# EAGLE design sonoff DIY, 3 gang(SMD version-V.1.1) (EAGLE 9.6.2)
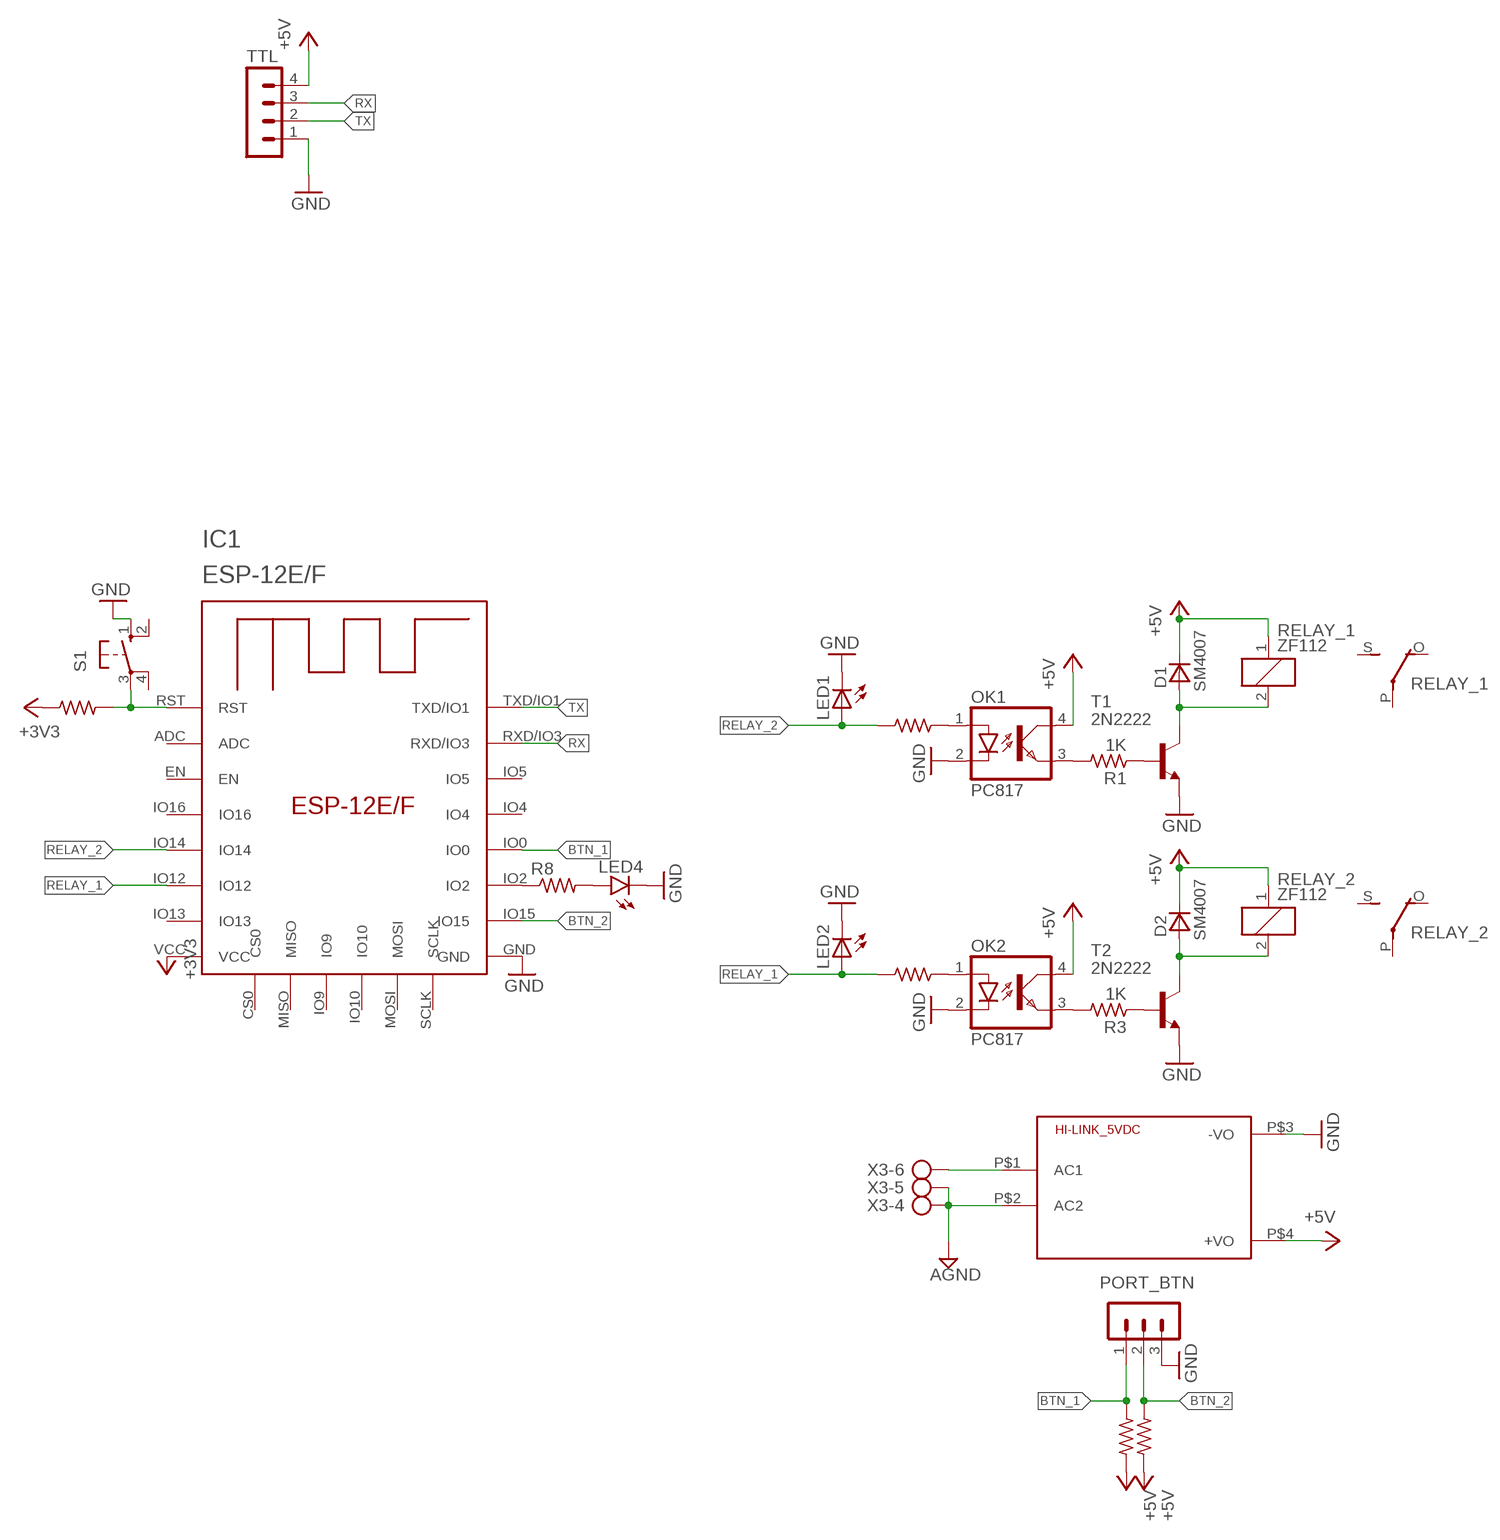
[diagram p0: schematic, sheet 1]

## Parts
D1  SM4007  [MELF-MLL41]
D2  SM4007  [MELF-MLL41]
HI-LINK_5VDC  HLK-PM013W  [HLK-PM01]
IC1  ESP-12E/F  [ESP-12E]
LED1  LED3MM  [LED3MM]
LED2  LED3MM  [LED3MM]
LED4  LED3MM  [LED3MM]
OK1  PC817  [DIL04]
OK2  PC817  [DIL04]
PORT_BTN  MA03-1  [MA03-1]
R1  1K  R_0805  [R0805]
R2  1K  R_0805  [R0805]
R3  1K  R_0805  [R0805]
R4  1K  R_0805  [R0805]
R5  1K  R_0805  [R0805]
R6  1K  R_0805  [R0805]
R7  1K  R_0805  [R0805]
R8  R-US_0207/10  [0207/10]
RELAY_1  ZF112  [ZF112]
RELAY_2  ZF112  [ZF112]
S1  10-XX  [B3F-10XX]
T1  2N2222  [TO18]
T2  2N2222  [TO18]
TTL  MA04-1  [MA04-1]
X3  SMKDSP_1,5/6  [SMKDSP_1,5/6]

## Nets
+3V3: IC1.VCC R7.2
+5V: D1.C D2.C HI-LINK_5VDC.P$4(+VO) OK1.4(COL) OK2.4(COL) R5.2 R6.2 RELAY_1.1 RELAY_2.1 TTL.4
AGND: HI-LINK_5VDC.P$2(AC2) X3.4 X3.5
BTN_1: IC1.IO0 PORT_BTN.1 R5.1
BTN_2: IC1.IO15 PORT_BTN.2 R6.1
GND: HI-LINK_5VDC.P$3(-VO) IC1.GND LED1.K(C) LED2.K(C) LED4.K(C) OK1.2(C) OK2.2(C) PORT_BTN.3 S1.1(S) T1.1(E) T2.1(E) TTL.1
N$1: OK1.1(A) R2.1
N$2: OK1.3(EMIT) R1.2
N$3: R1.1 T1.2(B)
N$4: D1.A RELAY_1.2 T1.3(C)
N$6: OK2.1(A) R4.1
N$7: HI-LINK_5VDC.P$1(AC1) X3.6
N$8: OK2.3(EMIT) R3.2
N$9: R3.1 T2.2(B)
N$10: D2.A RELAY_2.2 T2.3(C)
N$12: IC1.RST R7.1 S1.3(P)
N$15: IC1.IO2 R8.1
N$16: LED4.A R8.2
RELAY_1: IC1.IO12 LED2.A R4.2
RELAY_2: IC1.IO14 LED1.A R2.2
RX: IC1.RXD/IO3 TTL.3
TX: IC1.TXD/IO1 TTL.2
Unconnected: IC1.ADC IC1.CS0 IC1.EN IC1.IO4 IC1.IO5 IC1.IO9 IC1.IO10 IC1.IO13 IC1.IO16 IC1.MISO IC1.MOSI IC1.SCLK RELAY_1.O(2:O) RELAY_1.P(2:P) RELAY_1.S(2:S) RELAY_2.O(2:O) RELAY_2.P(2:P) RELAY_2.S(2:S) S1.2(S1) S1.4(P1) X3.1 X3.2 X3.3

## Library data of the parts
D1 D2 = _mod_diode:SM400*: SM4001 .. SM4007 General Purpose Rectifier, 1 A SMD-Version of 1N4001 .. 1N4007 Case: MELF-MLL41 = DO 213 AB Author: Dipl.-Ing. FH Rainer Bayer HHN Hochschule Heilbronn, rainer.bayer@hs-heilbronn.de Ingenieurbüro ing-rb, mail@ing-rb.de
HI-LINK_5VDC = HLK-PM01:HLK-PM01: Hi-Link Power Supply HLK-PM01 3W Author: Ahmed Said <https://github.com/AhmedSaid/EAGLELibraries>
IC1 = esp-12e-f:ESP-12E/F
LED1 LED2 LED4 = led:LED: LED OSRAM: - CHIPLED LG R971, LG N971, LY N971, LG Q971, LY Q971, LO R971, LY R971 LH N974, LH R974 LS Q976, LO Q976, LY Q976 LO Q996 - Hyper CHIPLED LW Q18S LB Q993, LB Q99A, LB R99A - SideLED LS A670, LO A670, LY A670, LG A670, LP A670 LB A673, LV A673, LT A673, LW A673 LH A674 LY A675 LS A676, LA A676, LO A676, LY A676, LW A676 LS A679, LY A679, LG A679 - Hyper Micro SIDELED® LS Y876, LA Y876, LO Y876, LY Y876 LT Y87S - SmartLED LW L88C, LW L88S LB L89C, LB L89S, LG L890 LS L89K, LO L89K, LY L89K LS L896, LA L896, LO L896, LY L896 - TOPLED LS T670, LO T670, LY T670, LG T670, LP T670 LSG T670, LSP T670, LSY T670, LOP T670, LYG T670 LG T671, LOG T671, LSG T671 LB T673, LV T673, LT T673, LW T673 LH T674 LS T676, LA T676, LO T676, LY T676, LB T676, LH T676, LSB T676, LW T676 LB T67C, LV T67C, LT T67C, LS T67K, LO T67K, LY T67K, LW E67C LS E67B, LA E67B, LO E67B, LY E67B, LB E67C, LV E67C, LT E67C LW T67C LS T679, LY T679, LG T679 LS T770, LO T770, LY T770, LG T770, LP T770 LB T773, LV T773, LT T773, LW T773 LH T774 LS E675, LA E675, LY E675, LS T675 LS T776, LA T776, LO T776, LY T776, LB T776 LHGB T686 LT T68C, LB T68C - Hyper Mini TOPLED® LB M676 - Mini TOPLED Santana® LG M470 LS M47K, LO M47K, LY M47K Source: http://www.osram.convergy.de LUXEON: - LUMILED® LXK2-PW12-R00, LXK2-PW12-S00, LXK2-PW14-U00, LXK2-PW14-V00 LXK2-PM12-R00, LXK2-PM12-S00, LXK2-PM14-U00 LXK2-PE12-Q00, LXK2-PE12-R00, LXK2-PE12-S00, LXK2-PE14-T00, LXK2-PE14-U00 LXK2-PB12-K00, LXK2-PB12-L00, LXK2-PB12-M00, LXK2-PB14-N00, LXK2-PB14-P00, LXK2-PB14-Q00 LXK2-PR12-L00, LXK2-PR12-M00, LXK2-PR14-Q00, LXK2-PR14-R00 LXK2-PD12-Q00, LXK2-PD12-R00, LXK2-PD12-S00 LXK2-PH12-R00, LXK2-PH12-S00 LXK2-PL12-P00, LXK2-PL12-Q00, LXK2-PL12-R00 Source: www.luxeon.com KINGBRIGHT: KA-3528ASYC Source: www.kingbright.com
OK1 OK2 = optocoupler:PC817: SHARP OPTO COUPLER; MPN: PC817X4J000F; OC_FARNELL: 9707727; OC_NEWARK: 97K7059
PORT_BTN = con-lstb:MA03-1: PIN HEADER; OC_FARNELL: unknown; OC_NEWARK: unknown
R1-R7 = rc-master-smd:R_: RESISTOR
R8 = resistor:R-US_: RESISTOR, American symbol
RELAY_1 RELAY_2 = relay:ZF112: RELAY 1 x switch; OC_FARNELL: unknown; OC_NEWARK: unknown
S1 = switch-omron:10-XX: OMRON SWITCH; MPN: B3F-1000; OC_FARNELL: 176432; OC_NEWARK: 36M3542
T1 T2 = transistor:2N2222: NPN TRANSISTOR
TTL = con-lstb:MA04-1: PIN HEADER; OC_FARNELL: unknown; OC_NEWARK: unknown
X3 = con-phoenix-smkdsp:SMKDSP_1,5/6: Printklemme, Nennstrom: 17,5 A, Bemessungsspannung: 250 V, Raster: 5,0 mm Source: http://eshop.phoenixcontact.de .. 1733415.pdf; MF: FARNELL; MPN: 1733619; OC_FARNELL: 3041270; OC_NEWARK: 71C4132

## Board
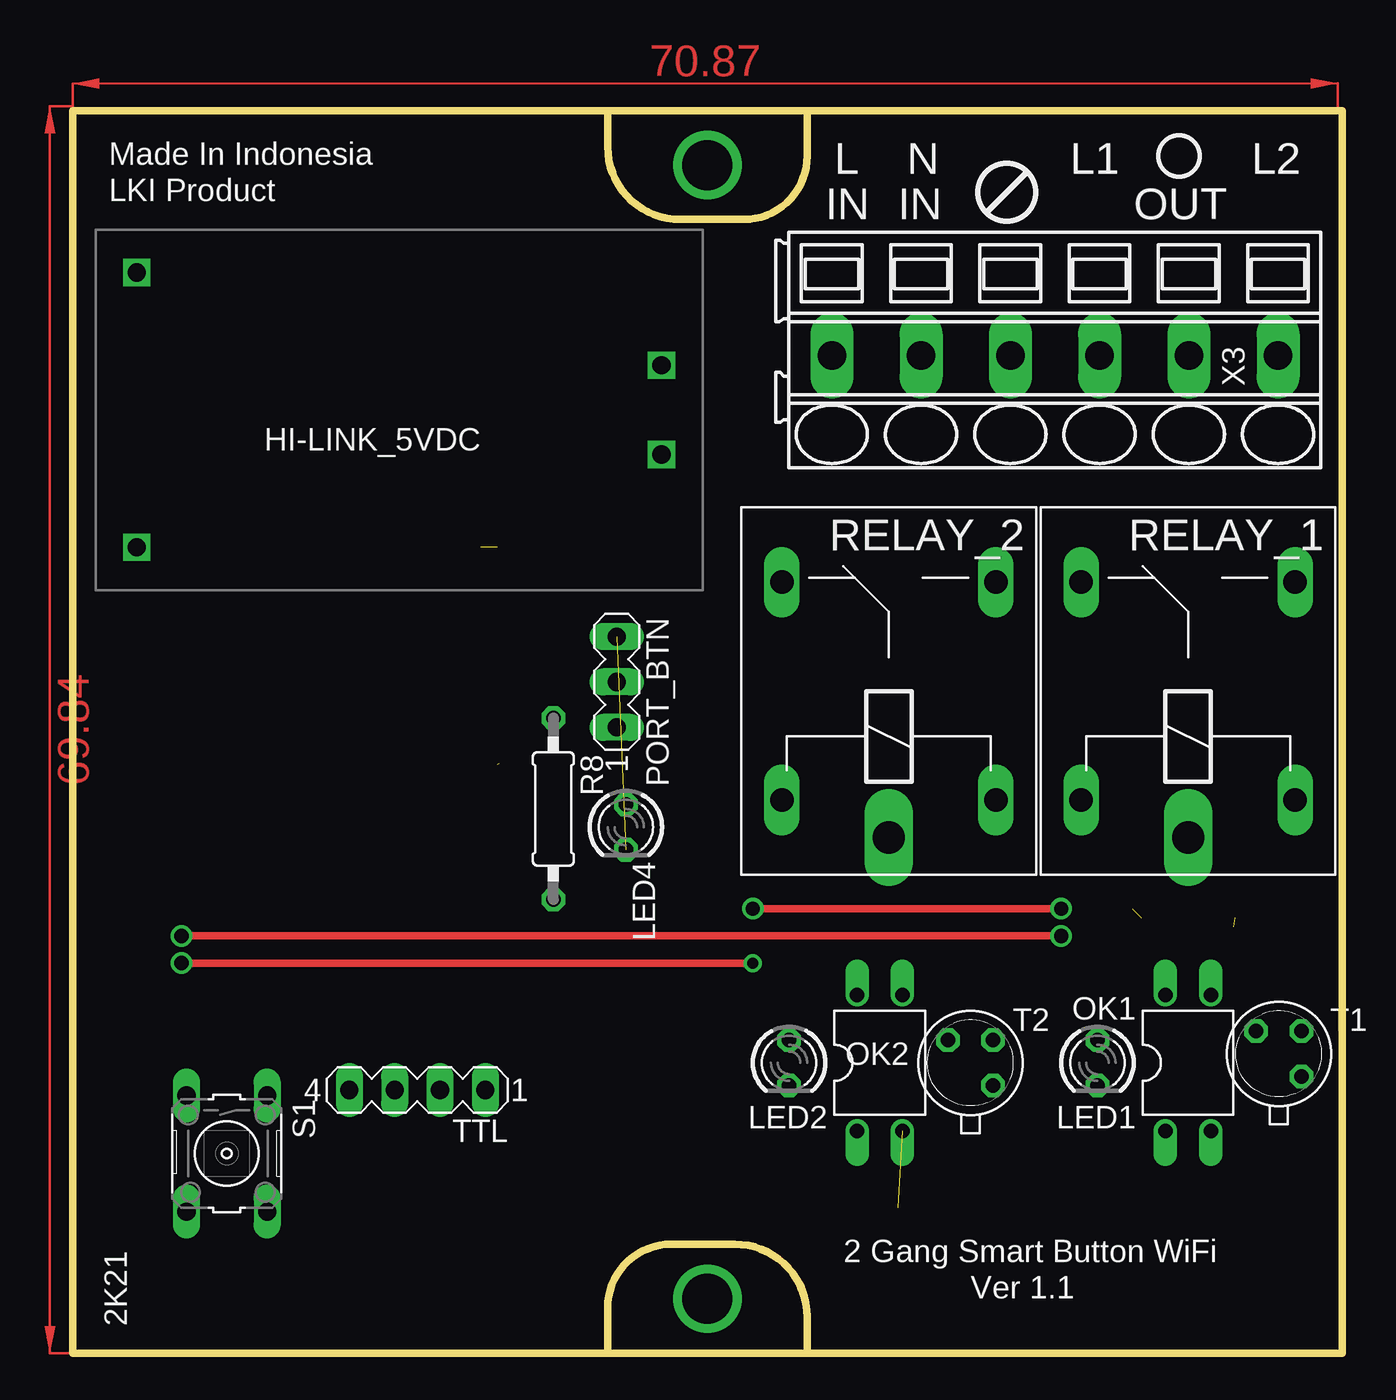
[diagram p1: board, top side]
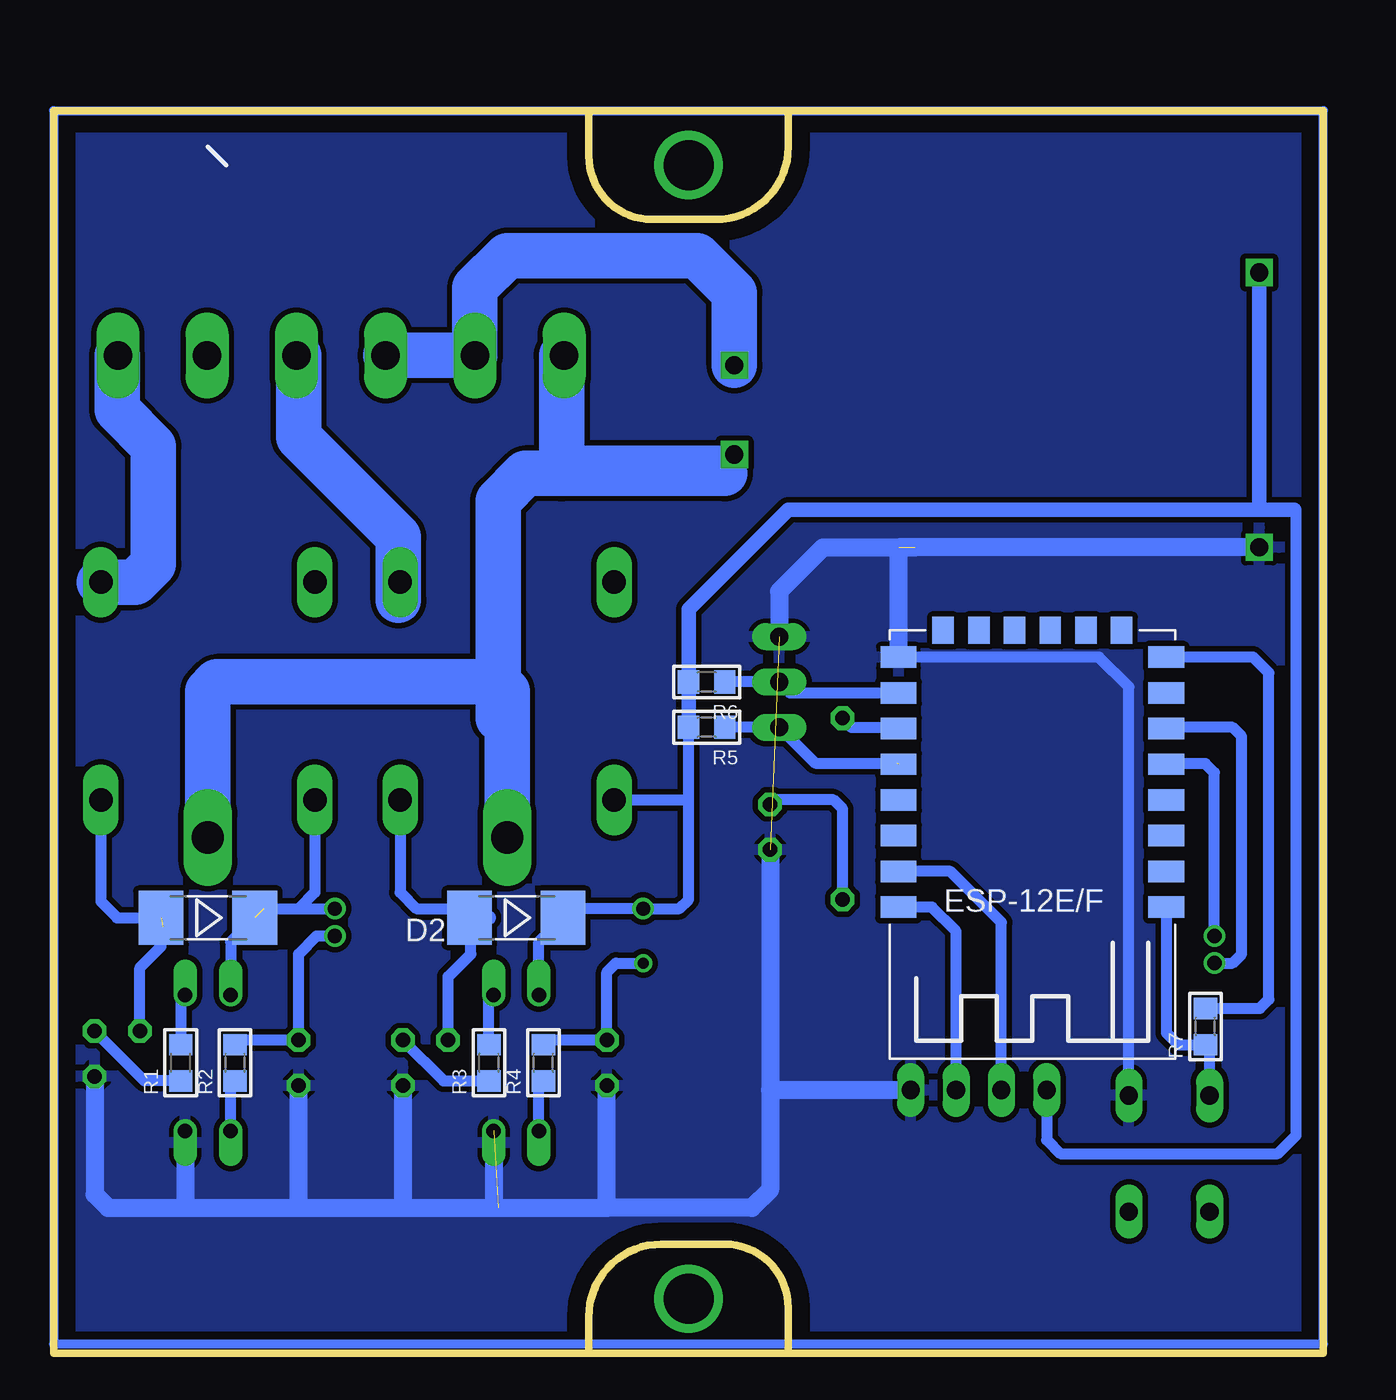
[diagram p2: board, bottom side, seen from below]

Size 71.12 x 69.6 mm. Coordinates in mm from the lower left corner, seen from the top.
Outline: 29.97,69.6 0,69.6 0,0 29.97,0
Outline: 29.97,69.6 29.97,67.56 arc90 34.04,63.5 37.59,63.5 arc90 41.15,67.06 41.15,69.6
Outline: 41.15,69.6 71.12,69.6 71.12,0 41.15,0
Outline: 41.15,0 41.15,2.03 arc90 37.08,6.1 33.53,6.1 arc90 29.97,2.54 29.97,0
Outline: 29.97,69.6 41.15,69.6
Outline: 29.97,0 41.15,0
Copper layers (1*16): Top 0.035mm / dielectric 1.5mm / Bottom 0.035mm
Design rules "default": minimum track width 10mil, minimum drill 24mil, track to track 8mil, track to pad 8mil, pad to pad 8mil, via to via 8mil, smd to smd 8mil, copper to edge 40mil, drill to drill 8mil, minimum pad ring 10mil, minimum via ring 8mil, stop-mask expansion 4mil, vias tented up to drill 0mil, thermal gap 10mil

### Footprints (pad centres in the part's own frame; a part is rotated, then mirrored left to right if it is on the bottom)
MELF-MLL41 = smd 2.5 x 3: A 2.625,0; C -2.625,0
HLK-PM01 = drill 1.016 square: P$1 -14.7,2.5; P$2 -14.7,-2.5; P$3 14.7,7.7; P$4 14.7,-7.7
ESP-12E = smd 2 x 1.2: ADC -7.46,5.53; EN -7.46,3.53; GND 7.54,-6.47; IO0 7.54,-0.47; IO2 7.54,-2.47; IO4 7.54,1.53; IO5 7.54,3.53; IO12 -7.46,-2.47; IO13 -7.46,-4.47; IO14 -7.46,-0.47; IO15 7.54,-4.47; IO16 -7.46,1.53; RST -7.46,7.53; RXD/IO3 7.54,5.53; TXD/IO1 7.54,7.53; VCC -7.46,-6.47 | smd 1.2 x 1.5: CS0 -4.96,-7.97; IO9 -0.96,-7.97; IO10 1.04,-7.97; MISO -2.96,-7.97; MOSI 3.04,-7.97; SCLK 5.04,-7.97
LED3MM = drill 0.813 octagon: A -1.27,0; K 1.27,0
DIL04 = drill 0.813 offset: 1 -1.27,-3.81; 2 1.27,-3.81; 3 1.27,3.81; 4 -1.27,3.81
MA03-1 = drill 1.016 long: 1 -2.54,0; 2 0,0; 3 2.54,0
R0805 = smd 1.2 x 1.3: 1 -1.016,0; 2 1.016,0
0207/10 = drill 0.813 octagon: 1 -5.08,0; 2 5.08,0
ZF112 = drill 1.321 long: 1 -6.096,5.994; 2 -6.096,-5.994; O 6.096,5.994; S 6.096,-5.994 | drill 1.803 long: P -8.204,0
B3F-10XX = drill 1.016 long: 1 -3.251,2.261; 2 3.251,2.261; 3 -3.251,-2.261; 4 3.251,-2.261
TO18 = drill 0.813 octagon: 1 -1.27,-1.27; 2 1.27,-1.27; 3 1.27,1.27
MA04-1 = drill 1.016 long: 1 -3.81,0; 2 -1.27,0; 3 1.27,0; 4 3.81,0
SMKDSP_1,5/6 = drill 1.6 pad 1.8 long: 1 -2.5,0; 2 2.5,0; 3 7.5,0; 4 12.5,0; 5 17.5,0; 6 22.5,0

### Placement (x,y rotation side)
D1  62.48,24.38 180 bottom
D2  45.21,24.38 180 bottom
HI-LINK_5VDC  18.29,52.83 180 top
IC1  16.26,32.51 180 bottom
LED1  57.4,16.26 270 top
LED2  40.13,16.26 270 top
LED4  30.99,29.46 270 top
OK1  62.48,16.26 0 top
OK2  45.21,16.26 0 top
PORT_BTN  30.48,37.59 90 top
R1  64.01,16.26 90 bottom
R2  60.96,16.26 90 bottom
R3  46.74,16.26 90 bottom
R4  43.69,16.26 90 bottom
R5  34.54,35.05 180 bottom
R6  34.54,37.59 180 bottom
R7  6.6,18.29 90 bottom
R8  26.92,30.48 270 top
RELAY_1  62.48,37.08 90 top
RELAY_2  45.72,37.08 90 top
S1  8.64,11.18 270 top
T1  67.56,16.76 90 top
T2  50.29,16.26 90 top
TTL  19.3,14.73 180 top
X3  65.02,55.88 180 top

### Tracks (layer width: path | path; a pad name or v marks a point on that pad's centre or on a via)
+3V3
  Bottom 0.61: R7.2 3.56,19.3 3.05,19.81 3.05,38.1 3.93,38.98 IC1.VCC
+5V  (via drill 0.8)  (1 unrouted)
  Top 0.406: v55.37,24.89 v38.1,24.89
  Bottom 0.61: D1.C 61.21,23.03 OK1.4 | OK2.4 43.94,23.03 D2.C 42.08,24.89 v38.1,24.89 36.07,24.89 35.56,25.4 35.56,30.99 | 59.35,24.89 57.4,24.89 | 57.4,24.89 v55.37,24.89 | RELAY_1.1 56.49,25.81 57.4,24.89 | 35.56,30.99 R5.2 | RELAY_2.1 35.56,30.99 | TTL.4 15.49,11.94 14.73,11.18 2.54,11.18 1.52,12.19 1.52,47.14 1.63,47.24
  Bottom 0.813: 60.45,23.79 D1.C 59.94,24.38 | D2.C 42.67,24.3 | 3.59,47.24 HI-LINK_5VDC.P$4 | 3.59,47.24 29.97,47.24 35.56,41.66 R6.2 R5.2 | 1.63,47.24 3.59,47.24
AGND
  Bottom 2.54: HI-LINK_5VDC.P$2 32.99,59.4 35.06,61.47 45.72,61.47 47.52,59.66 X3.5 X3.4
BTN_1  (1 unrouted)
  Bottom 0.61: 23.9,33.05 28.47,33.05 PORT_BTN.1 R5.1
BTN_2
  Bottom 0.61: R6.1 PORT_BTN.2 29.87,36.98 IC1.IO15
GND  (3 unrouted)
  Bottom 0.406: 40.13,14.48 LED2.K | 23.8,45.05 23.88,45.13
  Bottom 0.61: S1.1 10.9,37.31 12.57,38.98 IC1.GND
  Bottom 1.016: HI-LINK_5VDC.P$3 23.8,45.13 | 22.86,45.13 23.88,45.13 28.02,45.13 30.48,42.67 PORT_BTN.3 | T2.1 51.56,8.38 51.82,8.13 | 51.82,8.13 46.23,8.13 | 40.13,8.13 46.48,8.13 OK2.2 | 40.13,8.13 LED2.K | T1.1 68.83,8.89 68.07,8.13 63.75,8.13 63.5,8.13 | 63.5,8.13 62.99,8.13 57.4,8.13 | 57.4,8.13 LED1.K | 57.4,8.13 51.82,8.13 | 40.13,8.13 32,8.13 30.99,9.14 30.99,14.73 | IC1.GND 23.8,45.05 | LED4.K 30.99,14.73 | TTL.1 30.99,14.73 | OK1.2 63.75,8.38 63.5,8.13
  pour Bottom (isolate 0.305): 0,69.6 71.12,69.6 71.12,0 0,0
N$1
  Bottom 0.61: OK1.1 61.21,14.99 R2.1
N$2
  Bottom 0.61: OK1.3 64.01,19.81 R1.2
N$3
  Bottom 0.61: R1.1 66.04,15.24 T1.2
N$4  (1 unrouted)
  Bottom 0.61: T1.3 66.29,21.59 65.11,22.78 D1.A 67.56,24.38 68.48,25.3 RELAY_1.2
  Bottom 0.813: 64.52,23.88 65.02,23.88
N$5
  Bottom 2.54: 45.72,27.43 45.72,37.08 46.23,37.59 61.98,37.59 62.48,37.08 62.48,27.43
N$6
  Bottom 0.61: OK2.1 43.94,14.99 R4.1
N$7
  Bottom 1.016: HI-LINK_5VDC.P$1 41.62,50.33 42.67,49.28 42.67,55.73 X3.6
N$8
  Bottom 0.61: R3.2 46.74,19.81 OK2.3
N$9
  Bottom 0.61: T2.2 49.28,15.24 R3.1
N$10
  Bottom 0.61: T2.3 49.02,21.08 47.75,22.35 47.75,24.3 D2.A 47.75,24.47 47.75,24.89 50.8,24.89 51.71,25.81 RELAY_2.2
  Bottom 0.813: 46.74,24.38 D2.A
N$11
  Bottom 2.54: 46.23,35.56 46.23,47.75 44.7,49.28 42.67,49.28 | 33.53,49.28 42.67,49.28 | 42.67,55.88 42.67,49.28
N$12
  Bottom 0.61: IC1.RST 8.8,17.94 8.13,17.27 R7.1 6.38,17.04 S1.3
N$13
  Bottom 2.54: 68.58,43.18 66.55,43.18 65.53,44.2 65.53,50.8 67.56,52.83 67.56,55.88
N$14
  Bottom 2.54: 51.82,42.16 51.82,45.72 57.4,51.31 57.4,55.88
N$15
  Bottom 0.61: R8.1 26.42,35.05 23.87,35.05 IC1.IO2
N$16
  Bottom 0.61: R8.2 26.92,30.48 27.43,30.99 30.73,30.99 LED4.A
N$21  (via drill 2.8 pad 1.27)
  other vias: 35.56,66.55
N$28  (via drill 2.8 pad 1.27)
  other vias: 35.56,3.05
N$30
  Bottom 0.508: 71.12,69.6 0,69.6 0,0.51 71.12,0.51 71.12,69.6
RELAY_1  (via drill 0.61, 0.8)
  Top 0.406: v38.1,21.84 v6.1,21.84
  Bottom 0.61: LED2.A 43.43,17.53 R4.2 | LED2.A 41.66,17.53 | v6.1,21.84 5.08,21.84 4.57,22.35 4.57,34.54 5.08,35.05 8.73,35.05 IC1.IO12 | LED2.A 40.13,21.34 39.62,21.84 v38.1,21.84
RELAY_2  (via drill 0.8)
  Top 0.406: v55.37,23.37 v6.1,23.37
  Bottom 0.61: R2.2 60.71,17.53 LED1.A 57.4,22.35 56.39,23.37 v55.37,23.37 | v6.1,23.37 6.1,32.51 6.6,33.02 8.76,33.02 IC1.IO14
RX
  Bottom 0.61: TTL.3 18.03,24.13 20.89,26.98 IC1.RXD/IO3
TX
  Bottom 0.61: TTL.2 20.57,23.62 21.93,24.98 IC1.TXD/IO1
(copper drawn outside any net)
  shapes: Top area x2

### Text on the board
tNames: Made In Indonesia | L | N | L1 | L2 | LKI Product | IN | IN | OUT | 2 Gang Smart Button WiFi | Ver 1.1 | 2K21